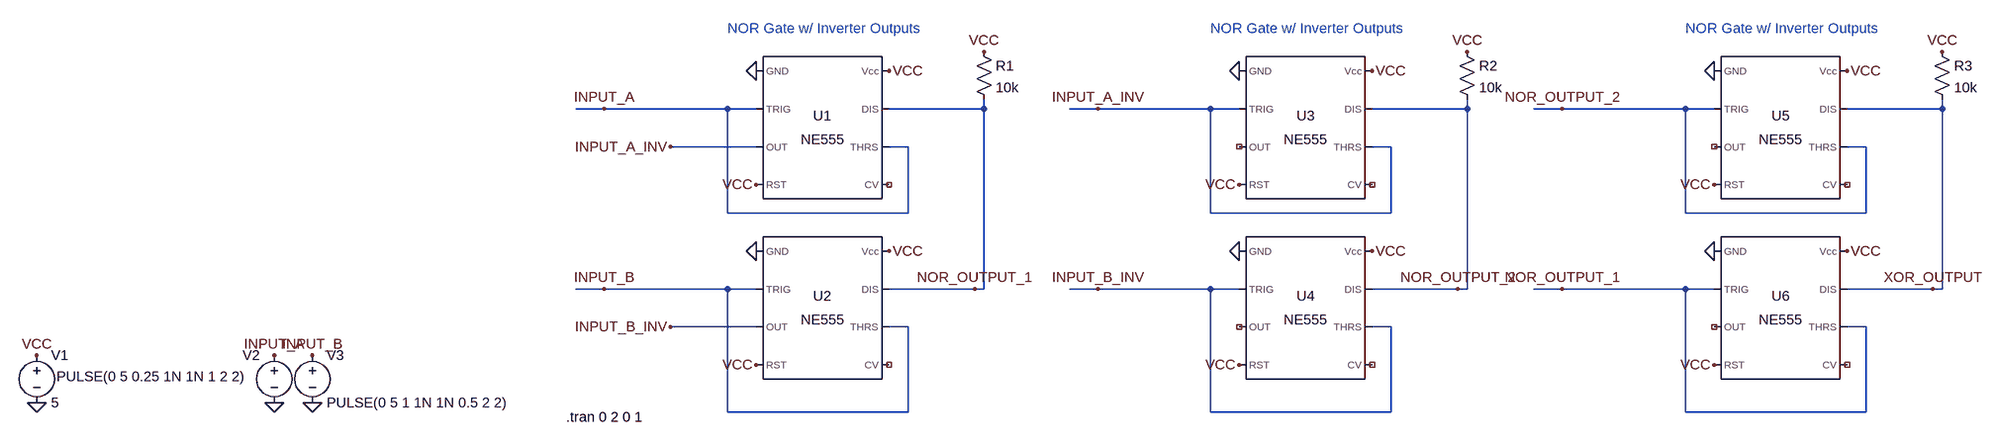
[diagram p0: schematic 555_XOR_Gate.asc]
555_XOR_Gate.asc, the LTspice schematic file:
Version 4
SHEET 1 2144 680
WIRE -224 48 -272 48
WIRE -16 48 -224 48
WIRE 32 48 -16 48
WIRE 416 48 416 32
WIRE 416 48 256 48
WIRE 608 48 560 48
WIRE 816 48 608 48
WIRE 864 48 816 48
WIRE 1248 48 1248 32
WIRE 1248 48 1088 48
WIRE 1408 48 1360 48
WIRE 1616 48 1408 48
WIRE 1664 48 1616 48
WIRE 2048 48 2048 32
WIRE 2048 48 1888 48
WIRE 32 112 -112 112
WIRE 288 112 256 112
WIRE 1120 112 1088 112
WIRE 1920 112 1888 112
WIRE -16 224 -16 48
WIRE 288 224 288 112
WIRE 288 224 -16 224
WIRE 816 224 816 48
WIRE 1120 224 1120 112
WIRE 1120 224 816 224
WIRE 1616 224 1616 48
WIRE 1920 224 1920 112
WIRE 1920 224 1616 224
WIRE -224 352 -272 352
WIRE -16 352 -224 352
WIRE 32 352 -16 352
WIRE 400 352 256 352
WIRE 416 352 416 48
WIRE 416 352 400 352
WIRE 608 352 560 352
WIRE 816 352 608 352
WIRE 864 352 816 352
WIRE 1232 352 1088 352
WIRE 1248 352 1248 48
WIRE 1248 352 1232 352
WIRE 1408 352 1360 352
WIRE 1616 352 1408 352
WIRE 1664 352 1616 352
WIRE 2032 352 1888 352
WIRE 2048 352 2048 48
WIRE 2048 352 2032 352
WIRE 32 416 -112 416
WIRE 288 416 256 416
WIRE 1120 416 1088 416
WIRE 1920 416 1888 416
WIRE -16 560 -16 352
WIRE 288 560 288 416
WIRE 288 560 -16 560
WIRE 816 560 816 352
WIRE 1120 560 1120 416
WIRE 1120 560 816 560
WIRE 1616 560 1616 352
WIRE 1920 560 1920 416
WIRE 1920 560 1616 560
FLAG -1216 544 0
FLAG -1216 464 VCC
FLAG 32 -16 0
FLAG 256 -16 VCC
FLAG 32 288 0
FLAG 256 288 VCC
FLAG -112 112 INPUT_A_INV
FLAG -112 416 INPUT_B_INV
FLAG -224 48 INPUT_A
FLAG -224 352 INPUT_B
FLAG 416 -48 VCC
FLAG 400 352 NOR_OUTPUT_1
FLAG -816 544 0
FLAG -816 464 INPUT_A
FLAG -752 544 0
FLAG -752 464 INPUT_B
FLAG 32 176 VCC
FLAG 32 480 VCC
FLAG 864 -16 0
FLAG 1088 -16 VCC
FLAG 864 288 0
FLAG 1088 288 VCC
FLAG 608 48 INPUT_A_INV
FLAG 608 352 INPUT_B_INV
FLAG 1248 -48 VCC
FLAG 1232 352 NOR_OUTPUT_2
FLAG 864 176 VCC
FLAG 864 480 VCC
FLAG 1664 -16 0
FLAG 1888 -16 VCC
FLAG 1664 288 0
FLAG 1888 288 VCC
FLAG 1408 48 NOR_OUTPUT_2
FLAG 1408 352 NOR_OUTPUT_1
FLAG 2048 -48 VCC
FLAG 2032 352 XOR_OUTPUT
FLAG 1664 176 VCC
FLAG 1664 480 VCC
SYMBOL voltage -1216 448 R0
SYMATTR InstName V1
SYMATTR Value 5
SYMBOL Misc\\NE555 144 80 R0
SYMATTR InstName U1
SYMBOL Misc\\NE555 144 384 R0
SYMATTR InstName U2
SYMBOL res 400 -64 R0
SYMATTR InstName R1
SYMATTR Value 10k
SYMBOL voltage -816 448 M0
WINDOW 3 49 52 Left 2
WINDOW 123 0 0 Left 0
WINDOW 39 0 0 Left 0
SYMATTR Value PULSE(0 5 0.25 1N 1N 1 2 2)
SYMATTR InstName V2
SYMBOL voltage -752 448 R0
WINDOW 123 0 0 Left 0
WINDOW 39 0 0 Left 0
SYMATTR InstName V3
SYMATTR Value PULSE(0 5 1 1N 1N 0.5 2 2)
SYMBOL Misc\\NE555 976 80 R0
SYMATTR InstName U3
SYMBOL Misc\\NE555 976 384 R0
SYMATTR InstName U4
SYMBOL res 1232 -64 R0
SYMATTR InstName R2
SYMATTR Value 10k
SYMBOL Misc\\NE555 1776 80 R0
SYMATTR InstName U5
SYMBOL Misc\\NE555 1776 384 R0
SYMATTR InstName U6
SYMBOL res 2032 -64 R0
SYMATTR InstName R3
SYMATTR Value 10k
TEXT -16 -88 Left 2 ;NOR Gate w/ Inverter Outputs
TEXT -288 568 Left 2 !.tran 0 2 0 1
TEXT 816 -88 Left 2 ;NOR Gate w/ Inverter Outputs
TEXT 1616 -88 Left 2 ;NOR Gate w/ Inverter Outputs

The netlist it stands for:
* 555_XOR_Gate.asc
V1 VCC 0 5
XU1 0 INPUT_A INPUT_A_INV VCC NC_01 INPUT_A NOR_OUTPUT_1 VCC NE555  ; pins GND TRIG OUT RST CV THRS DIS Vcc
XU2 0 INPUT_B INPUT_B_INV VCC NC_02 INPUT_B NOR_OUTPUT_1 VCC NE555  ; pins GND TRIG OUT RST CV THRS DIS Vcc
R1 VCC NOR_OUTPUT_1 10k
V2 INPUT_A 0 PULSE(0 5 0.25 1N 1N 1 2 2)
V3 INPUT_B 0 PULSE(0 5 1 1N 1N 0.5 2 2)
XU3 0 INPUT_A_INV NC_03 VCC NC_04 INPUT_A_INV NOR_OUTPUT_2 VCC NE555  ; pins GND TRIG OUT RST CV THRS DIS Vcc
XU4 0 INPUT_B_INV NC_05 VCC NC_06 INPUT_B_INV NOR_OUTPUT_2 VCC NE555  ; pins GND TRIG OUT RST CV THRS DIS Vcc
R2 VCC NOR_OUTPUT_2 10k
XU5 0 NOR_OUTPUT_2 NC_07 VCC NC_08 NOR_OUTPUT_2 XOR_OUTPUT VCC NE555  ; pins GND TRIG OUT RST CV THRS DIS Vcc
XU6 0 NOR_OUTPUT_1 NC_09 VCC NC_10 NOR_OUTPUT_1 XOR_OUTPUT VCC NE555  ; pins GND TRIG OUT RST CV THRS DIS Vcc
R3 VCC XOR_OUTPUT 10k
* NOR Gate w/ Inverter Outputs
.tran 0 2 0 1
* NOR Gate w/ Inverter Outputs
* NOR Gate w/ Inverter Outputs
.lib NE555.sub
.backanno
.end

* Results of the author's LTspice run, read from the files saved beside the schematic
* Operating Point, zero values left out:
*   V(vcc) = 5 V
*   V(nor_output_1) = 5 V
*   V(input_a_inv) = 5 V
*   V(input_b_inv) = 5 V
*   V(nor_output_2) = 5 V
*   V(xor_output) = 5 V
*   I(R3) = 13.34 nA
*   I(R2) = 23.34 nA
*   I(R1) = 23.34 nA
*   I(V1) = -9.666 mA
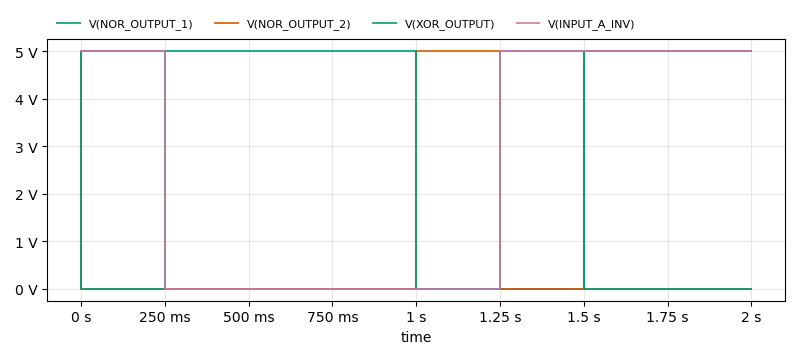
[diagram p1: Transient Analysis of 555_XOR_Gate.asc, plotted from the saved traces]
* Transient Analysis, 1 run:
*   V(NOR_OUTPUT_1): min 1.5 mV, max 5 V, average 1.877 V, rms 3.062 V, last 5 V
*   V(NOR_OUTPUT_2): min 1.5 mV, max 5 V, average 627 mV, rms 1.768 V, last 1.5 mV
*   V(XOR_OUTPUT): min 1.5 mV, max 5 V, average 2.501 V, rms 3.535 V, last 2.998 mV
*   V(INPUT_A_INV): min 30 µV, max 5 V, average 2.5 V, rms 3.536 V, last 5 V